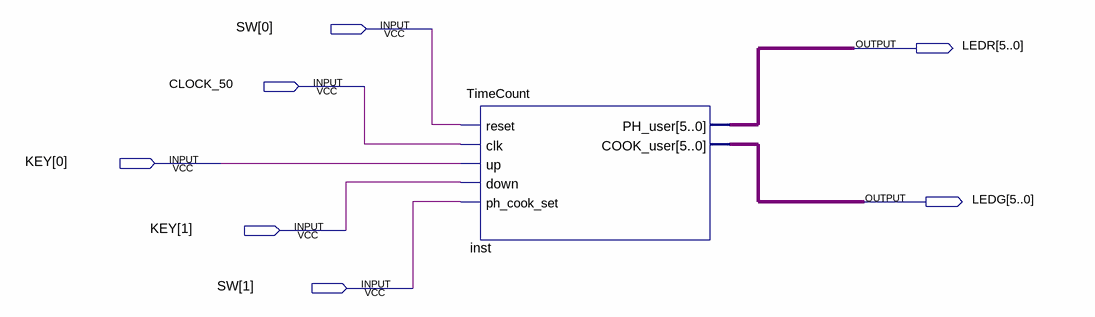
[diagram p0: schematic sheet]
// Quartus schematic TimeCount_Demo.bdf as structural Verilog: 1 symbols, 7 pins
module TimeCount_Demo (
  input  [1:0] SW,
  input  CLOCK_50,
  input  [1:0] KEY,
  output [5:0] LEDR,
  output [5:0] LEDG
);

  TimeCount inst (
    .reset(SW[0]), .clk(CLOCK_50), .up(KEY[0]), .down(KEY[1]), .ph_cook_set(SW[1]), .PH_user(LEDR),
    .COOK_user(LEDG));
endmodule
